# EAGLE board WatchSchematic (EAGLE 9.7.0), part 1 of 2
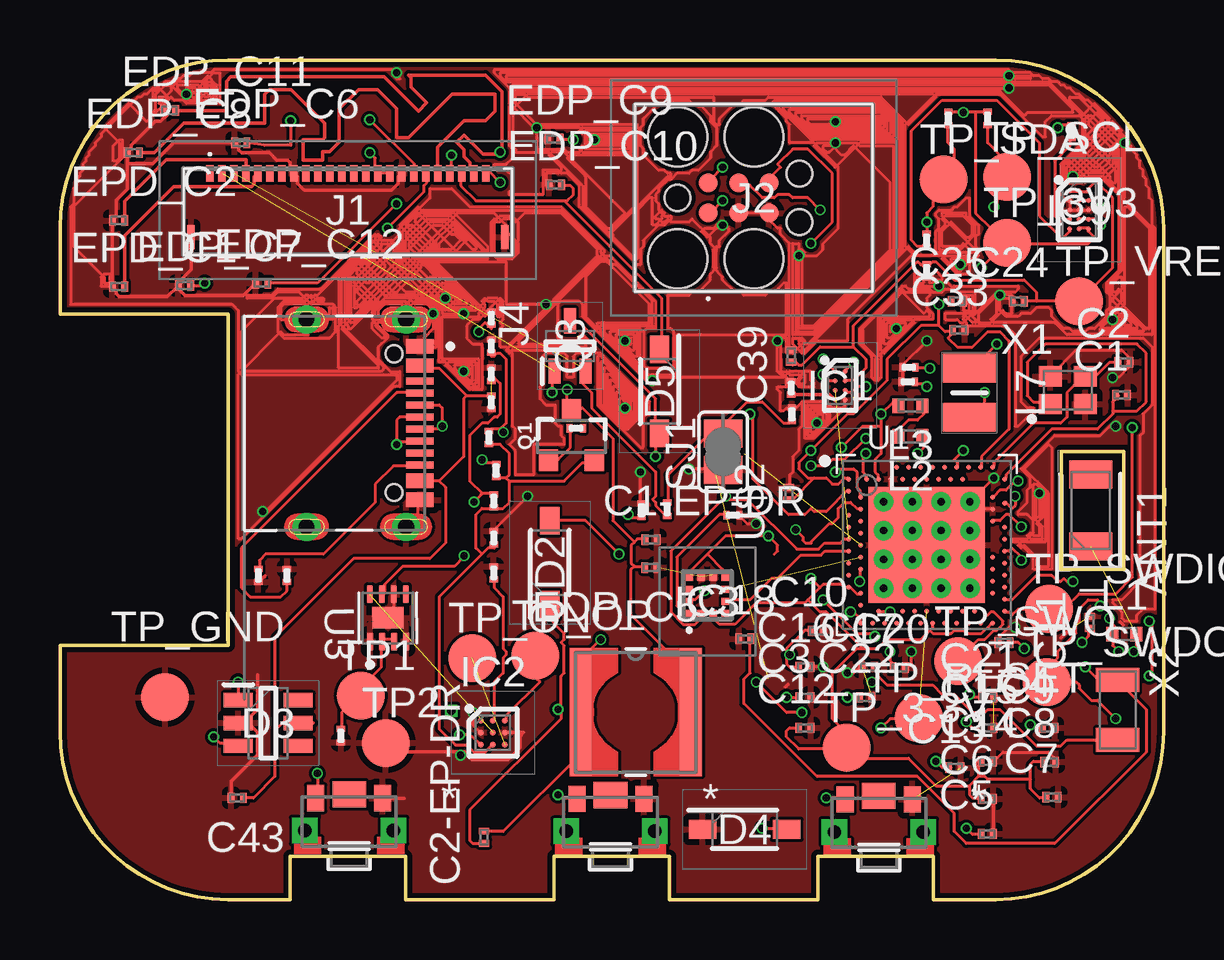
[diagram p2: board, top side]
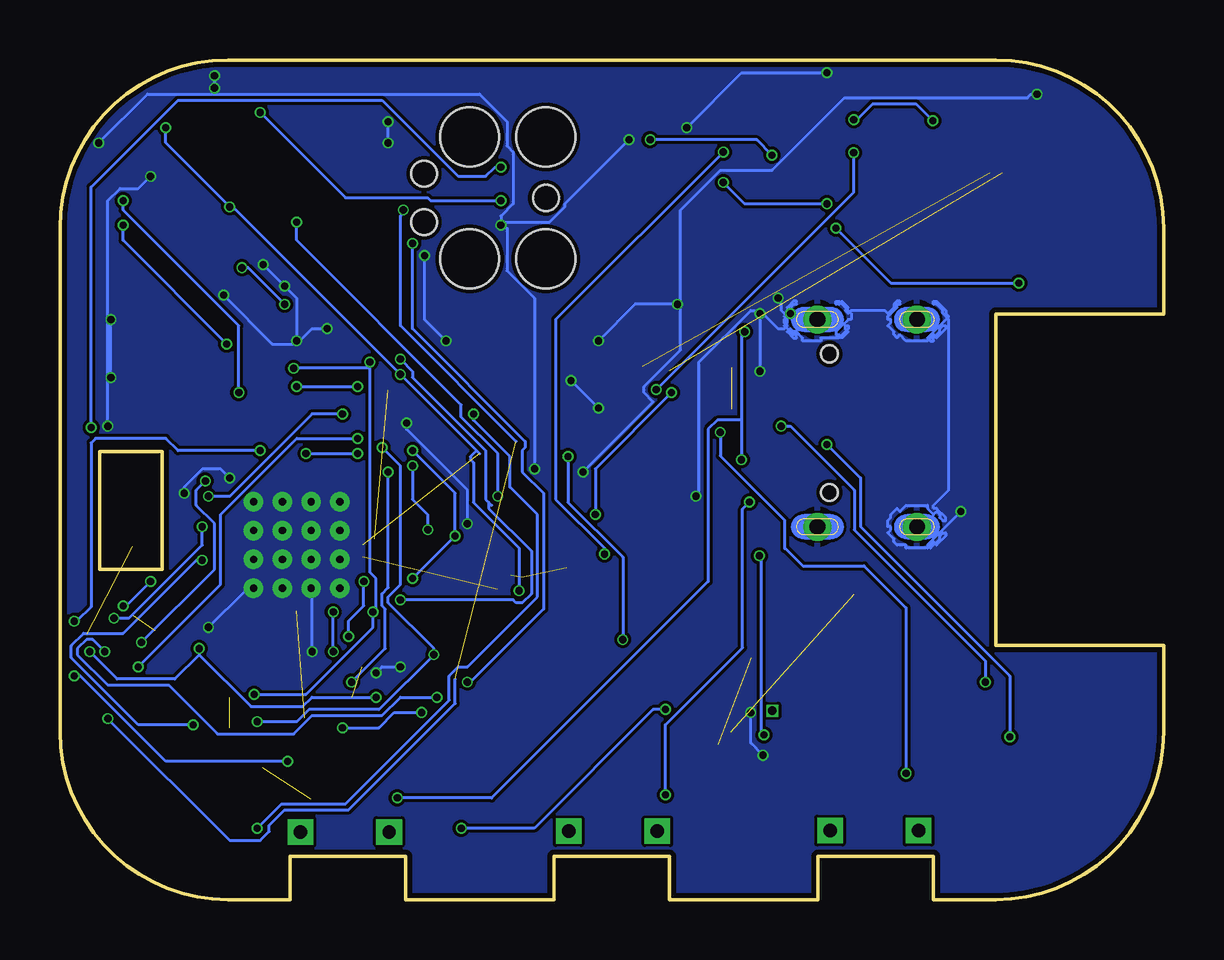
[diagram p3: board, bottom side, seen from below]

Size 46 x 35 mm. Coordinates in mm from the lower left corner, seen from the top.
Outline: 39,0 36.4,0 36.4,1.8 31.6,1.8 31.6,0 25.4,0 25.4,1.8 20.6,1.8 20.6,0 14.4,0 14.4,1.8 9.6,1.8 9.6,0 7,0 arc-90 0,7 0,10.6 7,10.6 7,24.4 0,24.4 0,28 arc-90 7,35 39,35 arc-90 46,28 46,7 arc-90 39,0
Outline: 41.74,18.67 44.34,18.67 44.34,13.77 41.74,13.77 41.74,18.67
Copper layers (1*16): Top 0.035mm / dielectric 1.6mm / Bottom 0.035mm
Design rules "jlcpcb-2layers.dru *": minimum track width 5mil, minimum drill 0.3mm, track to track 5mil, track to pad 5mil, pad to pad 5mil, via to via 5mil, smd to smd 5mil, copper to edge 0.2mm, drill to drill 6mil, minimum pad ring 10mil, minimum via ring 3mil, stop-mask expansion 4mil, vias tented up to drill 0mil, thermal gap 10mil

## Footprints (pad centres in the part's own frame; a part is rotated, then mirrored left to right if it is on the bottom)
2450AT18B100E_ANTC3216X140N = smd 1.15 x 1.8: 1 -1.5,0; 2 1.5,0
NORDIC_NRF_3_RESC0201_L = smd 0.28 x 0.43: 1 -0.255,0; 2 0.255,0
GRM011R60J152KE01L_1_0201 = smd 0.35 x 0.25: 1 0,0.275; 2 0,-0.275
ESP32_C6_LIBRARY_5_SOD3716X135N = smd 1.15 x 0.8: 1 -1.75,0; 2 1.75,0
ESP32_C6_LIBRARY_3_SOT95P280X145-6N = smd 1.2 x 0.6: 1 -1.25,0.95; 2 -1.25,0; 3 -1.25,-0.95; 4 1.25,-0.95; 5 1.25,0; 6 1.25,0.95
BQ25180YBGR_BGA8C40P2X4_100X155X50 = smd 0.2 x 0.2: A1 -0.2,0.6; A2 0.2,0.6; B1 -0.2,0.2; B2 0.2,0.2; C1 -0.2,-0.2; C2 0.2,-0.2; D1 -0.2,-0.6; D2 0.2,-0.6
DRV2605YZFR_BGA9C50P3X3_144X144X62 = smd 0.25 x 0.25: A1 -0.5,0.5; A2 0,0.5; A3 0.5,0.5; B1 -0.5,0; B2 0,0; B3 0.5,0; C1 -0.5,-0.5; C2 0,-0.5; C3 0.5,-0.5
BMA423_BMA423 = smd 0.3 x 0.35: 1 -0.75,-0.775; 2 -0.25,-0.775; 3 0.25,-0.775; 4 0.75,-0.775; 7 0.75,0.775; 8 0.25,0.775; 9 -0.25,0.775; 10 -0.75,0.775 | smd 0.35 x 0.3: 5 0.775,-0.25; 6 0.775,0.25; 11 -0.775,0.25; 12 -0.775,-0.25
RT6160AWSC_BGA15C40P3X5_140X230X60 = smd 0.216 x 0.216: A1 -0.4,0.8; A2 0,0.8; A3 0.4,0.8; B1 -0.4,0.4; B2 0,0.4; B3 0.4,0.4; C1 -0.4,0; C2 0,0; C3 0.4,0; D1 -0.4,-0.4; D2 0,-0.4; D3 0.4,-0.4; E1 -0.4,-0.8; E2 0,-0.8; E3 0.4,-0.8
503480-2400_5034802400 = smd 0.3 x 0.7: 1 -5.75,1.525; 2 -5.25,1.525; 3 -4.75,1.525; 4 -4.25,1.525; 5 -3.75,1.525; 6 -3.25,1.525; 7 -2.75,1.525; 8 -2.25,1.525; 9 -1.75,1.525; 10 -1.25,1.525; 11 -0.75,1.525; 12 -0.25,1.525; 13 0.25,1.525; 14 0.75,1.525; 15 1.25,1.525; 16 1.75,1.525; 17 2.25,1.525; 18 2.75,1.525; 19 3.25,1.525; 20 3.75,1.525; 21 4.25,1.525; 22 4.75,1.525; 23 5.25,1.525; 24 5.75,1.525 | smd 0.3 x 1: MP1 -6.54,-1.125; MP2 6.54,-1.125
TC2030-IDC_TC2030IDC = smd 0.783 x 0.783: 1 -0.953,-0.635; 2 -0.953,0.635; 3 0.317,-0.635; 4 0.317,0.635; 5 1.588,-0.635; 6 1.588,0.635 | hole 2.451: -2.223,-2.54; -2.223,2.54; 0.952,-2.54; 0.952,2.54 | hole 1.067: -2.223,0; 2.857,-1.016; 2.857,1.016
KH-TYPE-C-16P_KINGHELM_KH-TYPE-C-16P = smd 0.6 x 1.15: A1_B12 -3.2,4.725; A4_B9 -2.4,4.725; A9_B4 2.4,4.725; A12_B1 3.2,4.725 | smd 0.3 x 1.15: A5 -1.25,4.725; A6 -0.25,4.725; A7 0.25,4.725; A8 1.25,4.725; B5 1.75,4.725; B6 0.75,4.725; B7 -0.75,4.725; B8 -1.75,4.725 | drill 0.65 pad 1.05: SH1 -4.32,0; SH2 4.32,0; SH3 -4.32,4.15; SH4 4.32,4.15 | hole 0.7: -2.89,3.65; 2.89,3.65
NORDIC_NRF_2_RESC0402_L = smd 0.5 x 0.6: 1 -0.5,0; 2 0.5,0
ESP32_C6_LIBRARY_2_IND_4828-WE-TPC_WRE = smd 0.9 x 5.3: 1 -2.286,0; 2 2.286,0
MLP2016SR47MT0S1_INDC2016X100N = smd 1.2 x 2.2: 1 -1.028,0; 2 1.028,0
ESP32_C6_LIBRARY_4_ESP32_C6_LIBRARY_4_ESP32_C6_LIBRARY_4_ESP32_C6_LIBRARY_4_ESP32_WROVER_SPARKFUN-DISCRETESEMI_SOT23-3 = smd 0.8 x 0.9: 1 -0.95,-1; 2 0.95,-1; 3 0,1.1
ESP32_C6_LIBRARY_6_SOT65P210X110-3N = smd 1.05 x 0.5: 1 -1.05,0.65; 2 -1.05,-0.65; 3 1.05,0
CPF0201D7K68C1_0201 = smd 0.35 x 0.25: 1 0,0.275; 2 0,-0.275
ESP32_C6_LIBRARY_7_JUMPER_SJ = smd 1.168 x 1.6: 1 -0.762,0; 2 0.762,0
2025-10-22_07-23-44_LIBRARY_SW_EVP-AKE31A_PAN = smd 0.711 x 1.092: 1 -1.4,-0.972; 2 1.4,-0.972 | drill 0.559 pad 0.914 square: 3 -1.848,0.381; 4 1.848,0.381 | smd 1.397 x 1.092: 5 0,-1.124
HECTOR_WATCH_1_TP20R = smd 2 x 2: TP 0,0
NORDIC_NRF_4_AQFN50P700X700X85_HS-74N = smd 4.85 x 4.85: P$74 0,0 | drill 0.3 pad 0.6: P$75 -1.8,1.8; P$76 -0.6,1.8; P$77 0.6,1.8; P$78 1.8,1.8; P$79 -1.8,0.6; P$80 -0.6,0.6; P$81 0.6,0.6; P$82 1.8,0.6; P$83 -1.8,-0.6; P$84 -0.6,-0.6; P$85 0.6,-0.6; P$86 1.8,-0.6; P$87 -1.8,-1.8; P$88 -0.6,-1.8; P$89 0.6,-1.8; P$90 1.8,-1.8 | smd 0.2 x 0.2: P$A8 -1.25,3.25; P$A10 -0.75,3.25; P$A12 -0.25,3.25; P$A14 0.25,3.25; P$A16 0.75,3.25; P$A18 1.25,3.25; P$A20 1.75,3.25; P$A22 2.25,3.25; P$A23 2.75,3.25; P$AA24 3.25,-2.25; P$AB2 -2.75,-2.5; P$AC5 -2,-2.75; P$AC9 -1,-2.75; P$AC11 -0.5,-2.75; P$AC13 0,-2.75; P$AC15 0.5,-2.75; P$AC17 1,-2.75; P$AC19 1.5,-2.75; P$AC21 2,-2.75; P$AC24 3.25,-2.75; P$AD2 -2.75,-3.25; P$AD4 -2.25,-3.25; P$AD6 -1.75,-3.25; P$AD8 -1.25,-3.25; P$AD10 -0.75,-3.25; P$AD12 -0.25,-3.25; P$AD14 0.25,-3.25; P$AD16 0.75,-3.25; P$AD18 1.25,-3.25; P$AD20 1.75,-3.25; P$AD22 2.25,-3.25; P$AD23 2.75,-3.25; P$B1 -3.25,2.75; P$B3 -2.5,2.75; P$B5 -2,2.75; P$B7 -1.5,2.75; P$B9 -1,2.75; P$B11 -0.5,2.75; P$B13 0,2.75; P$B15 0.5,2.75; P$B17 1,2.75; P$B19 1.5,2.75; P$B24 3.25,2.75; P$C1 -3.25,2.25; P$D2 -2.75,2; P$D23 2.75,2; P$E24 3.25,1.75; P$F2 -2.75,1.5; P$F23 2.75,1.5; P$G1 -3.25,1.25; P$H2 -2.75,1; P$H23 2.75,1; P$J1 -3.25,0.75; P$J24 3.25,0.75; P$K2 -2.75,0.5; P$L1 -3.25,0.25; P$L24 3.25,0.25; P$M2 -2.75,0; P$N1 -3.25,-0.25; P$N24 3.25,-0.25; P$P2 -2.75,-0.5; P$P23 2.75,-0.5; P$R1 -3.25,-0.75; P$R24 3.25,-0.75; P$T2 -2.75,-1; P$T23 2.75,-1; P$U1 -3.25,-1.25; P$U24 3.25,-1.25; P$V23 2.75,-1.5; P$W1 -3.25,-1.75; P$W24 3.25,-1.75; P$Y2 -2.75,-2; P$Y23 2.75,-2
ESP32_C6_LIBRARY_SON50P200X200X80-9N = smd 0.76 x 0.27: 1 -0.985,0.75; 2 -0.985,0.25; 3 -0.985,-0.25; 4 -0.985,-0.75; 5 0.985,-0.75; 6 0.985,-0.25; 7 0.985,0.25; 8 0.985,0.75 | smd 0.9 x 1.3: 9 0,0
NORDIC_NRF_BT-XTAL_2016_N = smd 0.95 x 0.85: 1 -0.725,-0.575; 2 0.725,-0.575; 3 0.725,0.575; 4 -0.725,0.575
NORDIC_NRF_1_XTAL_3215_N = smd 1 x 1.8: 1 -1.25,0; 2 1.25,0

## Placement (x,y rotation side)
ANT1  2450AT18B100E_2450AT18B100E  [2450AT18B100E_ANTC3216X140N]  42.96,16.22 90 top
C1  12pF  [NORDIC_NRF_3_RESC0201_L]  44.25,21.03 0 top
C1-EP-DR  10uF  [NORDIC_NRF_3_RESC0201_L]  24.64,15 0 top
C2  12pF  [NORDIC_NRF_3_RESC0201_L]  44.35,22.4 0 top
C2-EP-DR  4.7uF/25V  [NORDIC_NRF_3_RESC0201_L]  17.68,2.6 90 top
C3  1pF  [NORDIC_NRF_3_RESC0201_L]  31.05,8.43 0 top
C4  1pF  [NORDIC_NRF_3_RESC0201_L]  39.35,10.71 180 top
C5  100nF  [NORDIC_NRF_3_RESC0201_L]  38.65,2.74 0 top
C6  4.7μF  [NORDIC_NRF_3_RESC0201_L]  38.65,4.2 0 top
C7  100nF  [NORDIC_NRF_3_RESC0201_L]  41.35,4.27 0 top
C8  100nF  [NORDIC_NRF_3_RESC0201_L]  41.25,5.73 0 top
C9  820pF  [NORDIC_NRF_3_RESC0201_L]  41.21,7.16 0 top
C10  N.C.  [NORDIC_NRF_3_RESC0201_L]  31.57,11.2 0 top
C11  100pF  [NORDIC_NRF_3_RESC0201_L]  42.93,11.56 90 top
C12  100nF  [NORDIC_NRF_3_RESC0201_L]  31.05,7.16 0 top
C13  N.C.  [NORDIC_NRF_3_RESC0201_L]  37.3,5.5 0 top
C14  4.7μF  [NORDIC_NRF_3_RESC0201_L]  38.65,5.76 0 top
C15  1.0μF  [NORDIC_NRF_3_RESC0201_L]  38.67,7.16 0 top
C16  47nF  [NORDIC_NRF_3_RESC0201_L]  31.05,9.7 0 top
C17  12pF  [NORDIC_NRF_3_RESC0201_L]  33.69,9.7 0 top
C18  12pF  [NORDIC_NRF_3_RESC0201_L]  28.55,10.87 0 top
C20  4.7μF  [NORDIC_NRF_3_RESC0201_L]  34.99,9.66 0 top
C21  4.7μF  [NORDIC_NRF_3_RESC0201_L]  38.67,8.43 0 top
C22  N.C.  [NORDIC_NRF_3_RESC0201_L]  33.59,8.43 0 top
C23  0.1uF  [GRM011R60J152KE01L_1_0201]  36.13,26.21 0 top
C24  10uF  [NORDIC_NRF_3_RESC0201_L]  39.94,24.94 0 top
C25  22uF  [NORDIC_NRF_3_RESC0201_L]  37.4,24.94 0 top
C27  0.1uF  [GRM011R60J152KE01L_1_0201]  11.71,6.83 180 top
C29  1uF  [GRM011R60J152KE01L_1_0201]  17.98,24.24 0 top
C30  1uF  [GRM011R60J152KE01L_1_0201]  17.98,23.07 0 top
C31  1uF  [GRM011R60J152KE01L_1_0201]  17.98,21.9 0 top
C32  1uF  [GRM011R60J152KE01L_1_0201]  18.08,13.61 0 top
C33  22uF  [NORDIC_NRF_3_RESC0201_L]  37.46,23.74 0 top
C34  0.1uF  [GRM011R60J152KE01L_1_0201]  18.08,15.08 0 top
C37  1uF  [GRM011R60J152KE01L_1_0201]  35.35,21.59 90 top
C38  1uF  [GRM011R60J152KE01L_1_0201]  35.38,22.19 90 top
C39  10uF  [NORDIC_NRF_3_RESC0201_L]  30.48,22.66 90 top
C42  0.1uF  [GRM011R60J152KE01L_1_0201]  17.98,20.73 0 top
C43  4.7uF  [NORDIC_NRF_3_RESC0201_L]  7.39,4.24 180 top
D2  ESP32_C6_LIBRARY_5_MBR0530  [ESP32_C6_LIBRARY_5_SOD3716X135N]  20.42,14.05 90 top
D3  ESP32_C6_LIBRARY_3_USBLC6-2SC6Y  [ESP32_C6_LIBRARY_3_SOT95P280X145-6N]  8.68,7.36 0 top
D4  ESP32_C6_LIBRARY_5_MBR0530  [ESP32_C6_LIBRARY_5_SOD3716X135N]  28.54,2.93 0 top
D5  ESP32_C6_LIBRARY_5_MBR0530  [ESP32_C6_LIBRARY_5_SOD3716X135N]  24.99,21.18 270 top
EDP_C5  0.1uF/50V  [NORDIC_NRF_3_RESC0201_L]  24.63,13.84 180 top
EDP_C6  1uF/50V  [NORDIC_NRF_3_RESC0201_L]  7.53,31.55 0 top
EDP_C7  1uF/50V  [NORDIC_NRF_3_RESC0201_L]  5.19,25.59 0 top
EDP_C8  1uF/50V  [NORDIC_NRF_3_RESC0201_L]  3.05,31.14 0 top
EDP_C9  1uF/50V  [NORDIC_NRF_3_RESC0201_L]  20.59,31.7 0 top
EDP_C10  1uF/50V  [NORDIC_NRF_3_RESC0201_L]  20.65,29.79 0 top
EDP_C11  1uF/50V  [NORDIC_NRF_3_RESC0201_L]  4.57,32.89 0 top
EDP_C12  1uF/50V  [NORDIC_NRF_3_RESC0201_L]  8.41,25.69 0 top
EPD_C1  1uF/50V  [NORDIC_NRF_3_RESC0201_L]  2.44,25.55 0 top
EPD_C2  1uF/50V  [NORDIC_NRF_3_RESC0201_L]  2.44,28.31 0 top
IC1  BQ25180YBGR_BQ25180YBGR  [BQ25180YBGR_BGA8C40P2X4_100X155X50]  32.52,21.43 0 top
IC2  DRV2605YZFR_DRV2605YZFR  [DRV2605YZFR_BGA9C50P3X3_144X144X62]  18.05,6.96 0 top
IC3  BMA423_BMA423  [BMA423_BMA423]  26.98,12.68 0 top
IC9  RT6160AWSC_RT6160AWSC  [RT6160AWSC_BGA15C40P3X5_140X230X60]  42.48,28.75 0 top
J1  503480-2400_503480-2400  [503480-2400_5034802400]  12,28.75 0 top
J2  TC2030-IDC_TC2030-IDC  [TC2030-IDC_TC2030IDC]  27.97,29.25 0 top
J4  KH-TYPE-C-16P_KH-TYPE-C-16P  [KH-TYPE-C-16P_KINGHELM_KH-TYPE-C-16P]  10.28,19.86 270 top
L1  3.9nH  [NORDIC_NRF_2_RESC0402_L]  44.37,11.06 0 top
L2  10μH  [NORDIC_NRF_2_RESC0402_L]  35.45,19.31 180 top
L3  15nH  [NORDIC_NRF_2_RESC0402_L]  35.45,20.59 180 top
L5  68uH  [ESP32_C6_LIBRARY_2_IND_4828-WE-TPC_WRE]  24,7.81 0 top
L7  MLP2016SR47MT0S1_FTC252012SR47MBCA  [MLP2016SR47MT0S1_INDC2016X100N]  37.9,21.13 90 top
Q1  20V/4.2A/52mΩ/1.4W  [ESP32_C6_LIBRARY_4_ESP32_C6_LIBRARY_4_ESP32_C6_LIBRARY_4_ESP32_C6_LIBRARY_4_ESP32_WROVER_SPARKFUN-DISCRETESEMI_SOT23-3]  21.32,19.3 0 top
Q3  ESP32_C6_LIBRARY_6_SI1308EDL-T1-GE3  [ESP32_C6_LIBRARY_6_SOT65P210X110-3N]  21.26,23.08 90 top
R1_EP_DR  0.47  [CPF0201D7K68C1_0201]  25.31,16.27 0 top
R1_USB  5K1  [CPF0201D7K68C1_0201]  9.46,13.51 0 top
R2  0  [CPF0201D7K68C1_0201]  36.13,27.48 0 top
R2_EP_DR  10K  [CPF0201D7K68C1_0201]  24.24,16.23 0 top
R2_USB  5K1  [CPF0201D7K68C1_0201]  8.27,13.51 0 top
R3  0  [CPF0201D7K68C1_0201]  28.05,16.02 270 top
R4  0  [CPF0201D7K68C1_0201]  42.16,32.01 0 top
R5  10k  [CPF0201D7K68C1_0201]  17.88,19.26 0 top
R7  10k  [CPF0201D7K68C1_0201]  18.18,17.89 0 top
R8  10k  [CPF0201D7K68C1_0201]  18.08,16.62 0 top
R9  10K  [CPF0201D7K68C1_0201]  30.48,21.33 0 top
R17  3K3  [CPF0201D7K68C1_0201]  38.67,32.56 0 top
R18  3K3  [CPF0201D7K68C1_0201]  37.03,32.56 0 top
R_PWR_EDP  10K  [CPF0201D7K68C1_0201]  21.52,19.65 90 top
R_TYPE_SEL  2.2  [CPF0201D7K68C1_0201]  30.51,20.23 0 top
SJ1  [ESP32_C6_LIBRARY_7_JUMPER_SJ]  27.64,18.67 90 top
SW_DN  2025-10-22_07-23-44_LIBRARY_EVP-AKE31ASW_EVP-AKE31A_PAN  [2025-10-22_07-23-44_LIBRARY_SW_EVP-AKE31A_PAN]  34.13,3.2 180 top
SW_ENT  2025-10-22_07-23-44_LIBRARY_EVP-AKE31ASW_EVP-AKE31A_PAN  [2025-10-22_07-23-44_LIBRARY_SW_EVP-AKE31A_PAN]  22.95,3.23 180 top
SW_UP  2025-10-22_07-23-44_LIBRARY_EVP-AKE31ASW_EVP-AKE31A_PAN  [2025-10-22_07-23-44_LIBRARY_SW_EVP-AKE31A_PAN]  12.06,3.26 180 top
TP1  HECTOR_WATCH_1_TPTP20R  [HECTOR_WATCH_1_TP20R]  12.54,8.5 0 top
TP2  HECTOR_WATCH_1_TPTP20R  [HECTOR_WATCH_1_TP20R]  13.57,6.53 0 top
TP_3.3V  HECTOR_WATCH_1_TPTP20R  [HECTOR_WATCH_1_TP20R]  32.79,6.33 0 top
TP_3V3  HECTOR_WATCH_1_TPTP20R  [HECTOR_WATCH_1_TP20R]  39.47,27.38 0 top
TP_GND  HECTOR_WATCH_1_TPTP20R  [HECTOR_WATCH_1_TP20R]  4.38,8.43 0 top
TP_ON  HECTOR_WATCH_1_TPTP20R  [HECTOR_WATCH_1_TP20R]  17.18,10.07 0 top
TP_OP  HECTOR_WATCH_1_TPTP20R  [HECTOR_WATCH_1_TP20R]  19.82,10.17 0 top
TP_RESET  HECTOR_WATCH_1_TPTP20R  [HECTOR_WATCH_1_TP20R]  35.8,7.57 0 top
TP_SCL  HECTOR_WATCH_1_TPTP20R  [HECTOR_WATCH_1_TP20R]  39.47,30.12 0 top
TP_SDA  HECTOR_WATCH_1_TPTP20R  [HECTOR_WATCH_1_TP20R]  36.83,30.02 0 top
TP_SWDCLK  HECTOR_WATCH_1_TPTP20R  [HECTOR_WATCH_1_TP20R]  41.14,9.07 0 top
TP_SWDIO  HECTOR_WATCH_1_TPTP20R  [HECTOR_WATCH_1_TP20R]  41.23,12.11 0 top
TP_SWO  HECTOR_WATCH_1_TPTP20R  [HECTOR_WATCH_1_TP20R]  37.44,9.93 0 top
TP_VREG  HECTOR_WATCH_1_TPTP20R  [HECTOR_WATCH_1_TP20R]  42.48,24.94 0 top
U1  NORDIC_NRF_4_NRF52840_QF  [NORDIC_NRF_4_AQFN50P700X700X85_HS-74N]  36.13,14.78 0 top
U3  ESP32_C6_LIBRARY_MAX17048G+T10  [ESP32_C6_LIBRARY_SON50P200X200X80-9N]  13.67,11.74 90.2 top
U$2  [NORDIC_NRF_3_RESC0201_L]  30.38,16.92 90 top
X1  32MHz  [NORDIC_NRF_BT-XTAL_2016_N]  42.01,21.23 0 top
X2  32.768kHz  [NORDIC_NRF_1_XTAL_3215_N]  44.08,7.9 270 top